# Altium schematic sheet pca20020_sheet3_io_expander.SchDoc: PCA20020 - IO Expander
size A4; DocumentNumber: 3; Revision: 1.0.0; SheetNumber: 3; SheetTotal: 9; DrawnBy: RUBR; PCBRevision: 0264RUBR; DocumentSize: A4; PCAName: PCA20020; PCBNumber: 400182
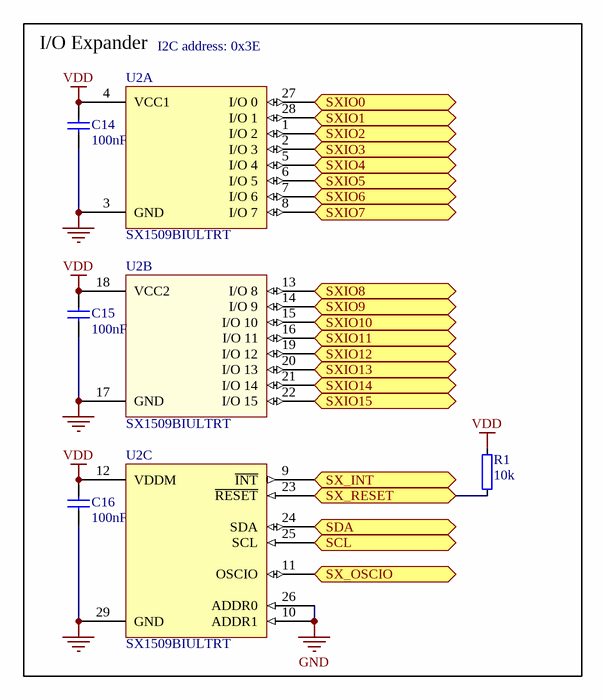
[diagram p0: pca20020_sheet3_io_expander.SchDoc]

## Parts
C14  100nF  [CAPC1005X04L]
C15  100nF  [CAPC1005X04L]
C16  100nF  [CAPC1005X04L]
R1  10k  [RESC1005X04L]
U2  SX1509BIULTRT  [QFN40P400X400X60_HS-29N]  (parts A,B,C of 3)

## Ports
SCL (bidir), SDA (bidir), SX_INT (bidir), SX_OSCIO (bidir), SX_RESET (bidir), SXIO0 (bidir), SXIO1 (bidir), SXIO2 (bidir), SXIO3 (bidir), SXIO4 (bidir), SXIO5 (bidir), SXIO6 (bidir), SXIO7 (bidir), SXIO8 (bidir), SXIO9 (bidir), SXIO10 (bidir), SXIO11 (bidir), SXIO12 (bidir), SXIO13 (bidir), SXIO14 (bidir), SXIO15 (bidir)

## Nets
GND: C14.1 C15.1 C16.1 U2.3(GND) U2.10(ADDR1) U2.17(GND) U2.26(ADDR0) U2.29(GND)
VDD: C14.2 C15.2 C16.2 R1.2 U2.4(VCC1) U2.12(VDDM) U2.18(VCC2)
SCL: U2.25(SCL) ; port SCL
SDA: U2.24(SDA) ; port SDA
SX_INT: U2.9(~{INT}) ; port SX_INT
SX_OSCIO: U2.11(OSCIO) ; port SX_OSCIO
SX_RESET: R1.1 U2.23(~{RESET}) ; port SX_RESET
SXIO0: U2.27(I/O_0) ; port SXIO0
SXIO1: U2.28(I/O_1) ; port SXIO1
SXIO2: U2.1(I/O_2) ; port SXIO2
SXIO3: U2.2(I/O_3) ; port SXIO3
SXIO4: U2.5(I/O_4) ; port SXIO4
SXIO5: U2.6(I/O_5) ; port SXIO5
SXIO6: U2.7(I/O_6) ; port SXIO6
SXIO7: U2.8(I/O_7) ; port SXIO7
SXIO8: U2.13(I/O_8) ; port SXIO8
SXIO9: U2.14(I/O_9) ; port SXIO9
SXIO10: U2.15(I/O_10) ; port SXIO10
SXIO11: U2.16(I/O_11) ; port SXIO11
SXIO12: U2.19(I/O_12) ; port SXIO12
SXIO13: U2.20(I/O_13) ; port SXIO13
SXIO14: U2.21(I/O_14) ; port SXIO14
SXIO15: U2.22(I/O_15) ; port SXIO15

## Notes on the sheet
- I/O Expander
- (near U2) I2C address: 0x3E
- Title
- Size
- Date:
- Project Number
- Sheet         of
- Revision
- File:
- Drawn By:

## Library data of the parts
C14-C16 = C0402-100n: Capacitor, X7R, ±10%; Part number IPS: 00000005296; Note: 16V; Artikkelnr Noca: 20039200; Artikkelnr Simpro: N.A.; Part Number: C0402-100n; Manufacturer: *; Manufacturer Part Number: *; Datasheet: *; Footprint Doc: 0402; LatestRevisionDate: 2009-11-23; Pin Count: 2; Publisher: Nordic Semiconductor; Published: 2009-05-08; Value: 100nF; Supplier: *; Supplier part number: *; 2nd source Supplier: *; 2nd source part number: *
R1 = R0402-10k: Resistor, ±1%, 0.063W; Part number IPS: 00000002093; Note: Chip Res 1%; Artikkelnr Noca: 27049097; Artikkelnr Simpro: N.A.; Value Ohm: 10000; Part Number: R0402-10k; Manufacturer: *; Manufacturer Part Number: *; Datasheet: *; Footprint Doc: 0402; LatestRevisionDate: 2009-11-23; Pin Count: 2; Publisher: Nordic Semiconductor; Published: 2009-05-08; Value: 10k; Supplier: Farnell; Supplier part number: 173-8864; 2nd source Supplier: *; 2nd source part number: *
U2 = SX1509BIULTRT: IC GPIO EXPANDER I2C 16CH 28QFN; Manufacturer: Semtech Corporation; Part number IPS: 00000007814; Artikkelnr Noca: N.A.; Part Number: SX1509BIULTRT; Manufacturer Part Number: SX1509BIULTRT; Datasheet: http://www.semtech.com/apps/product.php?pn=sx1509&x=0&y=0; Footprint Doc: QFN-28; LatestRevisionDate: 2015-03-10; Pin Count: 29; Publisher: Nordic Semiconductor; Published: 2015-03-10; Value: SX1509BIULTRT; Note: *; Supplier: Digi-Key; Supplier part number: SX1509BIULCT-ND; 2nd source Supplier: *; 2nd source part number: *; Artikkelnr Simpro: N.A.